# EasyEDA Pro project proyecto_diseno_2025_2.eprj

# Schematic Schematic1
Board Name: Board1; Create Date: 2025-09-25; Page Name: P1; Project Name: proyecto_diseno_2025_2; Schematic Name: Schematic1; Update Date: 2025-09-29; Company: EasyEDA.com; Page Size: A4; Version: V1.0
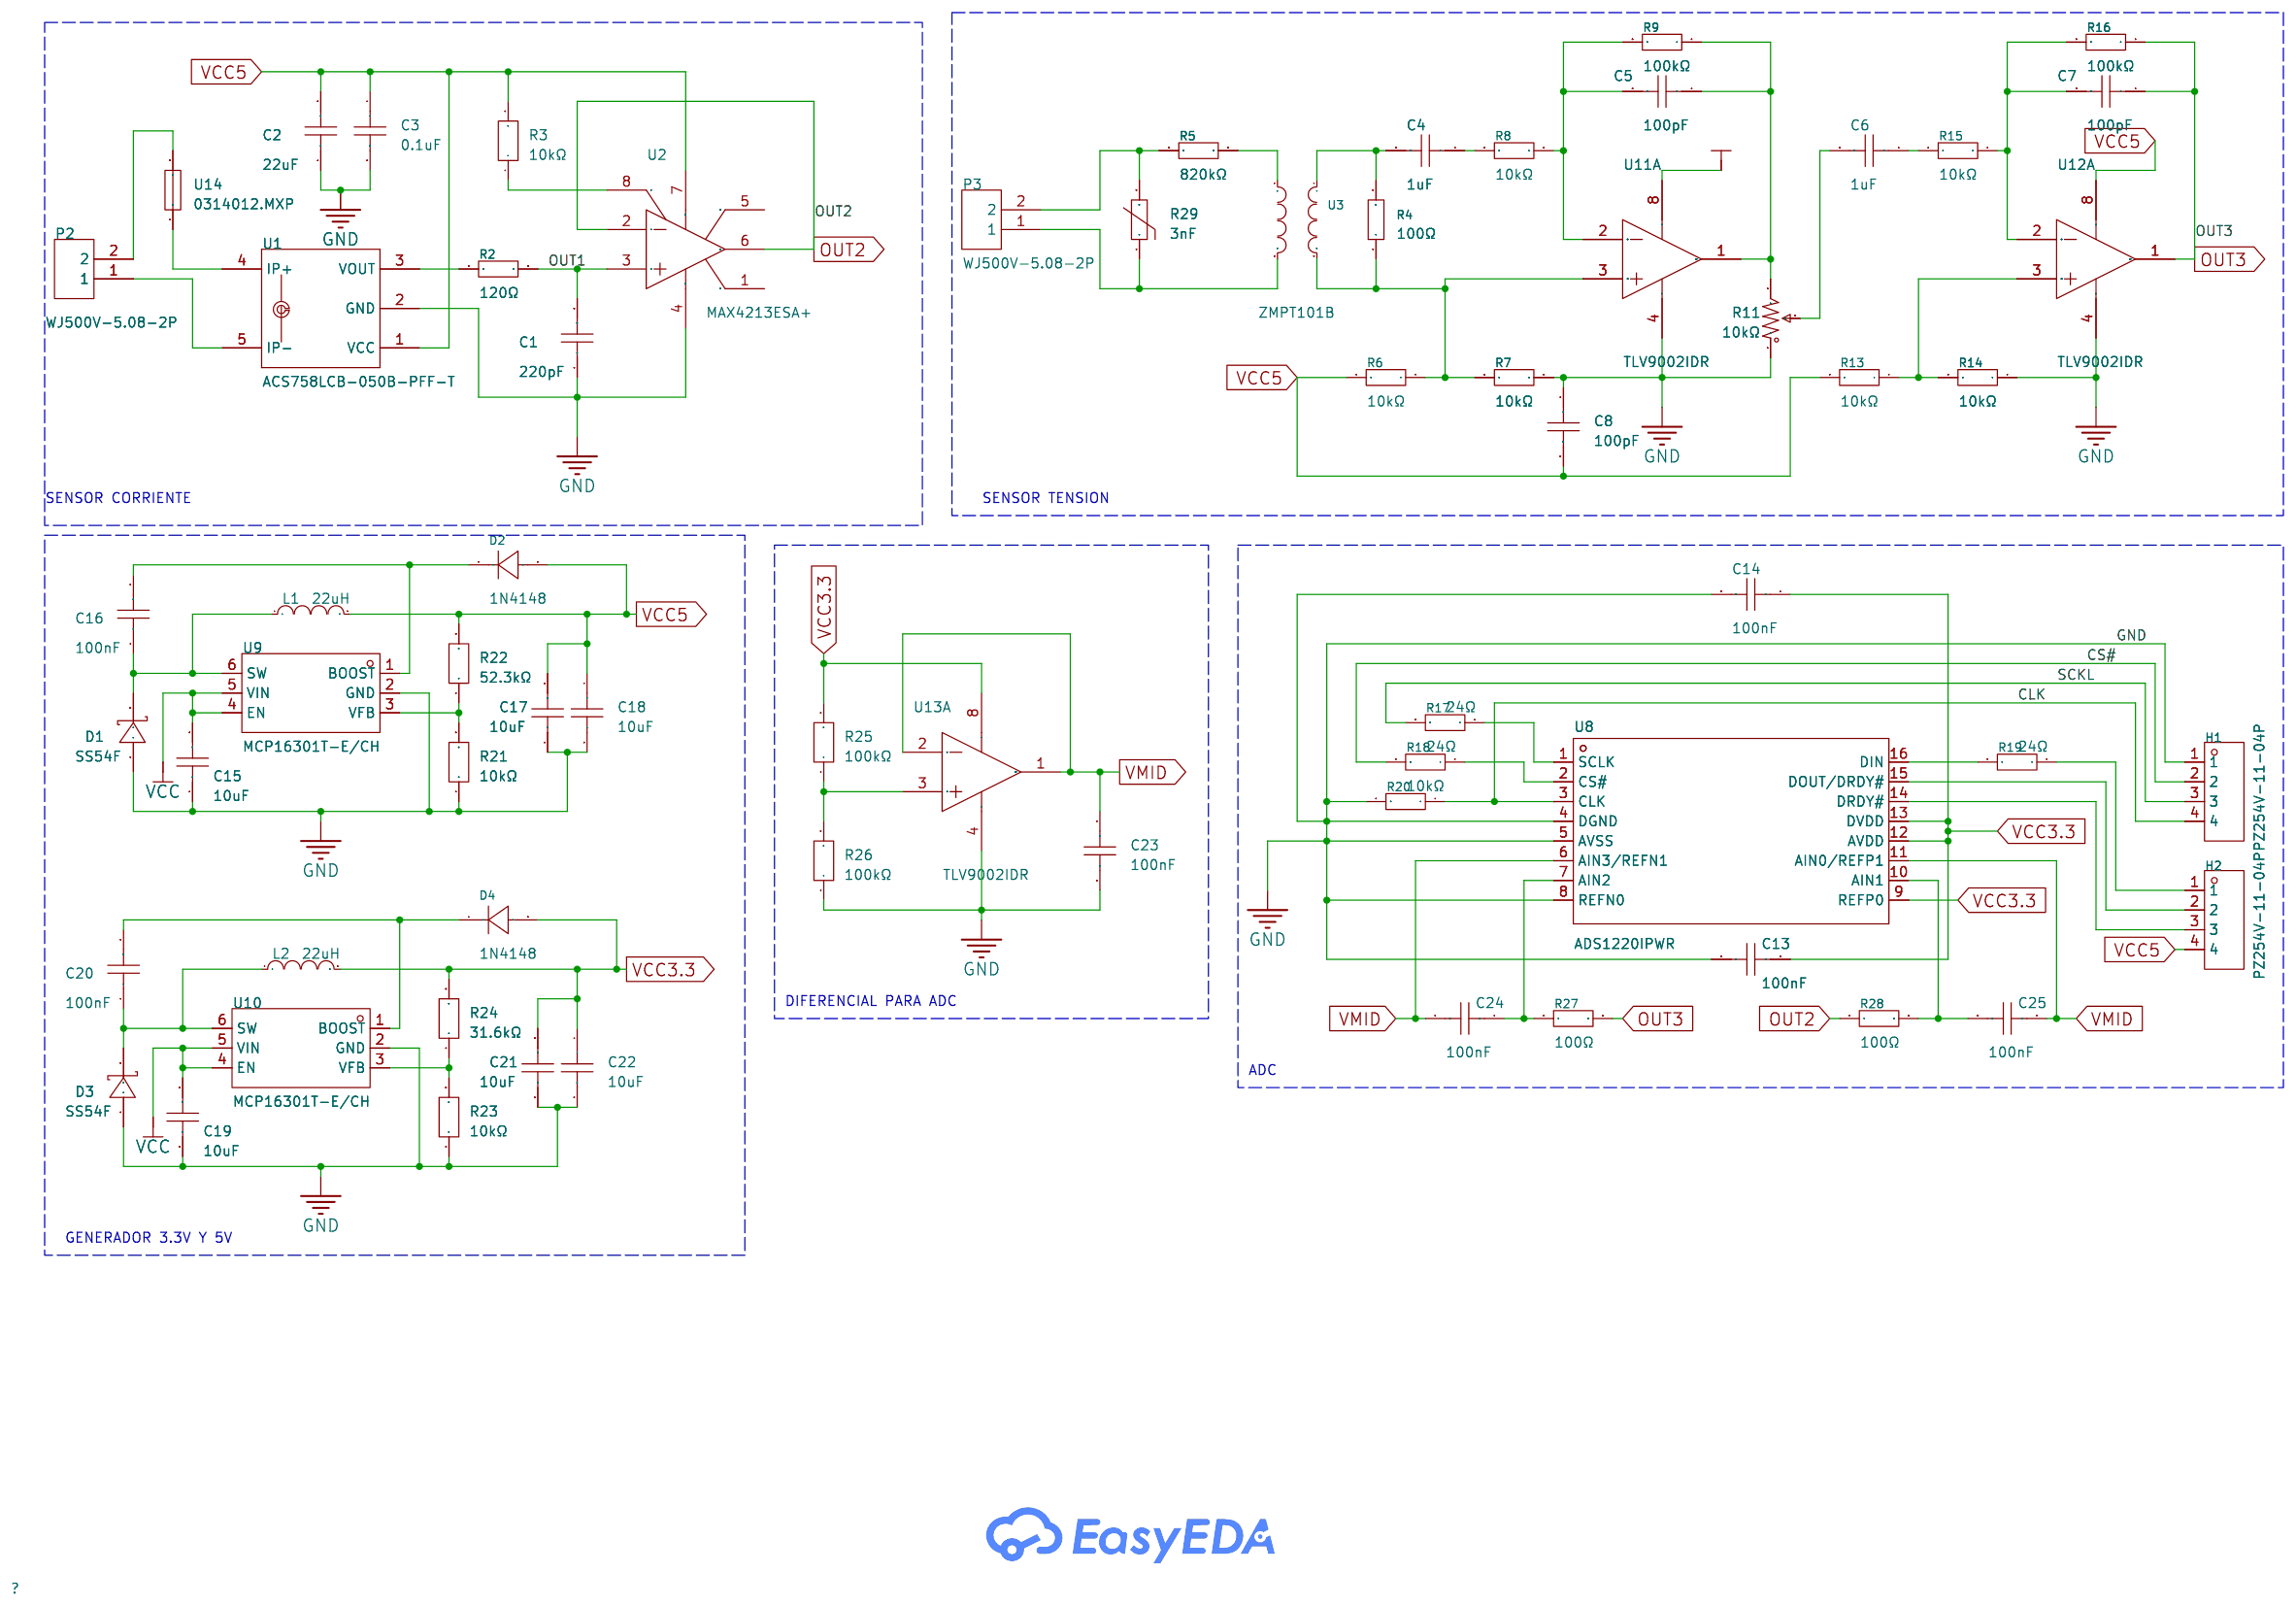
[diagram p0: schematic sheet]

## Parts
C1  220pF  [C0603]
C2  22uF  [C0603]
C3  0.1uF  [C0603]
C4  1uF  [C0603]
C5  100pF  [C0603]
C6  1uF  [C0603]
C7  100pF  [C0603]
C8  100pF  [C0603]
C13  100nF  [C0603]
C14  100nF  [C0603]
C15  10uF  [C0603]
C16  100nF  [C0603]
C17  10uF  [C0603]
C18  10uF  [C0603]
C19  10uF  [C0603]
C20  100nF  [C0603]
C21  10uF  [C0603]
C22  10uF  [C0603]
C23  100nF  [C0603]
C24  100nF  [C0603]
C25  100nF  [C0603]
D1  SS54F  [SMAF_L3.5-W2.6-LS4.7-FD]
D2  1N4148  [DO-35_BD2.0-L4.2-P8.20-D0.5-RD]
D3  SS54F  [SMAF_L3.5-W2.6-LS4.7-FD]
D4  1N4148  [DO-35_BD2.0-L4.2-P8.20-D0.5-RD]
H1  PZ254V-11-04P  [HDR-TH_4P-P2.54-V-M]
H2  PZ254V-11-04P  [HDR-TH_4P-P2.54-V-M]
L1  22uH  [L0603]
L2  22uH  [L0603]
P2  WJ500V-5.08-2P  [CONN-TH_2P-P5.00_WJ500V-5.08-2P]
P3  WJ500V-5.08-2P  [CONN-TH_2P-P5.00_WJ500V-5.08-2P]
R2  120Ω  [R0603]
R3  10kΩ  [R0603]
R4  100Ω  [R0603]
R5  820kΩ  [R0603]
R6  10kΩ  [R0603]
R7  10kΩ  [R0603]
R8  10kΩ  [R0603]
R9  100kΩ  [R0603]
R11  10kΩ  [RES-ADJ-TH_3P-L10.0-W10.0-P2.50-L]
R13  10kΩ  [R0603]
R14  10kΩ  [R0603]
R15  10kΩ  [R0603]
R16  100kΩ  [R0603]
R17  24Ω  [R0603]
R18  24Ω  [R0603]
R19  24Ω  [R0603]
R20  10kΩ  [R0603]
R21  10kΩ  [R0603]
R22  52.3kΩ  [R0603]
R23  10kΩ  [R0603]
R24  31.6kΩ  [R0603]
R25  100kΩ  [R0603]
R26  100kΩ  [R0603]
R27  100Ω  [R0603]
R28  100Ω  [R0603]
R29  3nF  [RES-TH_L15.5-W4.6-P7.50-D0.8-S3.00]
U1  ACS758LCB-050B-PFF-T  [SENSOR-TH_ACS758LCB-050B-PFF-T]
U2  MAX4213ESA+  [SO-8_L4.9-W3.9-P1.27-LS5.9-BL]
U3  ZMPT101B  [XFMR-TH_ZMPT101B]
U8  ADS1220IPWR  [TSSOP-16_L5.0-W4.4-P0.65-LS6.4-BL]
U9  MCP16301T-E/CH  [SOT-23-6_L2.9-W1.6-P0.95-LS2.8-BR]
U10  MCP16301T-E/CH  [SOT-23-6_L2.9-W1.6-P0.95-LS2.8-BR]
U11  TLV9002IDR  [SOIC-8_L4.9-W3.9-P1.27-LS6.0-BL]  (section 1)
U12  TLV9002IDR  [SOIC-8_L4.9-W3.9-P1.27-LS6.0-BL]  (section 1)
U13  TLV9002IDR  [SOIC-8_L4.9-W3.9-P1.27-LS6.0-BL]  (section 1)
U14  0314012.MXP  [FUSE-SMD_BD6.4-L31.8_0314020.MXP]

## Library data of the parts
C1-C8 C13-C25 = CC0603KRX7R9BB104: LCSC Part Name: 100nF ±10% 50V; Supplier Part: C14663; Manufacturer: YAGEO(国巨); Supplier Footprint: 0603; JLCPCB Part Class: Basic Part; Datasheet: https://item.szlcsc.com/datasheet/CC0603KRX7R9BB104/15331.html; Supplier: LCSC; Tolerance: ±10%; Voltage Rating: 50V; Temperature Coefficient: X7R
D1 D3 = SS54F_C524830: LCSC Part Name: 电压:40V 电流:5A; Supplier Part: C524830; Manufacturer: High Diode(海德); Supplier Footprint: SMAF; JLCPCB Part Class: Extended Part; Datasheet: https://item.szlcsc.com/datasheet/SS54F/542890.html; Supplier: LCSC; Diode Configuration: Independent; Voltage - Forward(Vf@If): 550mV@5A; Voltage - DC Reverse(Vr): 40V; Current - Rectified: 5A; Reverse Leakage Current (Ir): 500uA@40V; Operating Junction Temperature Range: -65℃~+150℃; Non-Repetitive Peak Forward Surge Current: 150A
D2 D4 = 1N4148_C493188: Supplier Part: C493188; Manufacturer: SMC(桑德斯); Supplier Footprint: DO-35; JLCPCB Part Class: Extended Part; Datasheet: https://item.szlcsc.com/datasheet/1N4148/503800.html; Supplier: LCSC; Diode Configuration: Independent; Voltage - Forward(Vf@If): 1V@10mA; Voltage - DC Reverse(Vr): 75V; Current - Rectified: 150mA; Reverse Leakage Current (Ir): 5uA@75V; Reverse Recovery Time (trr): 4ns; Operating Junction Temperature Range: -65℃~+175℃@(Tj); Non-Repetitive Peak Forward Surge Current: 2A
H1 H2 = PZ254V-11-04P: LCSC Part Name: 1x4P 间距:2.54mm 方针 直插; Supplier Part: C2691448; Manufacturer: XFCN(兴飞); Supplier Footprint: 插件,P=2.54mm; JLCPCB Part Class: Extended Part; Datasheet: https://item.szlcsc.com/datasheet/PZ254V-11-04P/2801085.html; Supplier: LCSC; Pin Structure: 1x4P; Pitch: 2.54mm; Circluar Pins/Square Pins: Pin Header; Mounting Type: Through Hole; Number of Rows: 1; Number of Pins: 4P; Current Rating: 3A; Voltage Rating (Max): 250V; Length of Mating Pin: 6mm; Insulation Height: 2.5mm; Length of End Connection Pin: 3mm; Operating Temperature: -40℃~+105℃; Color: Black
L1 L2 = L_0603
P2 P3 = WJ500V-5.08-2P: LCSC Part Name: 1x2P 5.08mm 直插 排数:1 每排P数:2; Supplier Part: C8465; Manufacturer: KANGNEX(康奈克斯电气); Supplier Footprint: 插件,P=5.08mm; JLCPCB Part Class: Extended Part; Datasheet: https://atta.szlcsc.com/upload/public/pdf/source/20191225/C8465_02D34CE5B5B4A53DF5891601D97FA9F4.pdf; Supplier: LCSC; Structure: 1x2P; Pitch: 5.08mm; Color: Green; Mounting Style: Direct Insert; Current Rating (Max): 18A; Voltage Rating (Max): 250V; Number of Pins: 2P; Number of Rows: 1; Wire Gauge - AWG: 14~30; Wire Gauge - mm2: 2.5; Number of PINs Per Row: 2; Operating Temperature Range: -40℃~+105℃; Screw Specification: M2.5
R2 R4-R9 R13-R20 R27 R28 = 0603WAF1200T5E: LCSC Part Name: 120Ω ±1% 100mW 厚膜电阻; Supplier Part: C22787; Manufacturer: UNI-ROYAL(厚声); Supplier Footprint: 0603; JLCPCB Part Class: Basic Part; Datasheet: https://atta.szlcsc.com/upload/public/pdf/source/20200306/C422600_1E6D84923E4A46A82E41ADD87F860B5C.pdf; Supplier: LCSC; Type: Thick Film Resistors; Tolerance: ±1%; Temperature Coefficient: ±100ppm/℃; Operating Temperature Range: -55℃~+155℃
R3 R21-R26 = FRC0603J103 TS: LCSC Part Name: 10kΩ ±5% 100mW 厚膜电阻; Supplier Part: C2930027; Manufacturer: FOJAN(富捷); Supplier Footprint: 0603; JLCPCB Part Class: Extended Part; Datasheet: https://item.szlcsc.com/datasheet/FRC0603J103%2520TS/3266960.html; Supplier: LCSC; Type: Thick Film Resistor; Tolerance: ±5%; Power(Watts): 100mW; Voltage-Supply(Max): 75V; Temperature Coefficient: ±100ppm/℃; Operating Temperature: -55℃~+155℃
R11 = 3296W-1-103_C118954: LCSC Part Name: 10kΩ ±10%; Supplier Part: C118954; Manufacturer: BOCHEN(博晨); Manufacturer Part: 3296W-1-103; Supplier Footprint: 插件-3P,9.5x4.9mm; JLCPCB Part Class: Extended Part; Datasheet: https://item.szlcsc.com/datasheet/3296W-1-103/120223.html; Supplier: LCSC; Tolerance: ±10%; Power(Watts): 500mW; Temperature Coefficient: ±250ppm/℃; Number of Turns: 30
R29 = 14D151K: Supplier Part: C49072884; Manufacturer: R+O(宏嘉诚); Supplier Footprint: 插件,P=7.5mm; JLCPCB Part Class: Extended Part; Datasheet: https://item.szlcsc.com/datasheet/14D151K/51445350.html; Supplier: LCSC; Varistor Voltage: 135V~165V; Clamping Voltage: 250V; Maximum DC Volts: 125V; Maximum AC Volts: 95V; Peak Current: 4.5kA; Energy: 47J; Rated Wattage: 600mW
U1 = ACS758LCB-050B-PFF-T_C6396157: Supplier Part: C6396157; Manufacturer: JSMSEMI(杰盛微); Supplier Footprint: CB-2-3; JLCPCB Part Class: Extended Part; Datasheet: https://atta.szlcsc.com/upload/public/pdf/source/20240105/D4861ACF7AD21FF5C22B7267E5615818.pdf; Supplier: LCSC; Current Range: ±50A; Supply Voltage: 4.5V~5.5V; Sensitivity: 40mV/A; Operating Temperature: -40℃~+150℃
U2 = MAX4213ESA+: LCSC Part Name: 微型、300MHz、单电源、 满摆幅运算放大器，带有使能端; Supplier Part: C194001; Manufacturer: ADI(亚德诺)/MAXIM(美信); Supplier Footprint: SO-8; JLCPCB Part Class: Extended Part; Datasheet: https://atta.szlcsc.com/upload/public/pdf/source/20180629/C194001_BE415C32D6D3EE348D3096D994F24335.pdf; Supplier: LCSC; Number of Channels: Single channel; Maximum Power Supply Range (Vdd-Vss): 10V; Vos - Input Offset Voltage: 9mV; Input Offset Voltage Drift(Vos TC): 8uV/℃; Slew Rate: 600V/us; Ib - Input Bias Current: 20uA; Noise density(eN): 10nV/√Hz@10kHz; Common Mode Rejection Ratio(CMRR): 100dB; Operating Temperature: -40℃~+85℃; Single supply: 3.3V~10V; Dual Supply: -5V~5V
U3 = ZMPT101B: Supplier Part: C111858; Manufacturer: 择明朗熙; Supplier Footprint: 插件; JLCPCB Part Class: Extended Part; Datasheet: https://item.szlcsc.com/datasheet/ZMPT101B/113087.html; Supplier: LCSC
U8 = ADS1220IPWR: LCSC Part Name: 具备集成特性的24位模数转换器（ADC）; Supplier Part: C48263; Manufacturer: TI(德州仪器); Supplier Footprint: TSSOP-16; JLCPCB Part Class: Extended Part; Datasheet: https://www.ti.com/cn/lit/gpn/ads1220; Supplier: LCSC; Resolution(Bits): 24; Sampling Rate: 2kHz; number of channels: 2; Voltage - Supply: 2.3V~5.5V; Interface: SPI; Integral non - linearity: 6LSB; Operating Temperature: -40℃~+125℃
U9 U10 = MCP16301T-E/CH: LCSC Part Name: 高输入电压集成开关降压稳压器; Supplier Part: C510952; Manufacturer: MICROCHIP(美国微芯); Supplier Footprint: SOT-23-6; JLCPCB Part Class: Extended Part; Datasheet: https://atta.szlcsc.com/upload/public/pdf/source/20200413/C510952_E610A357558B8BF4E97D896379FB269B.pdf; Supplier: LCSC; Function: Step-down type; Input Voltage: 4V~30V; Output Voltage: 2V~15V; Switching Frequency: 500kHz; Operating Temperature: -40℃~+125℃; Synchronous Rectification: No; Number of Outputs: 1; Topology: Step-down; Switch tube (built-in/external): Built-in
U11-U13 = TLV9002IDR: Supplier Part: C398360; Manufacturer: TI(德州仪器); Supplier Footprint: SOIC-8; JLCPCB Part Class: Extended Part; Datasheet: https://www.ti.com/cn/lit/gpn/tlv9001; Supplier: LCSC; Number of Channels: Dual; Maximum Power Supply Range (Vdd-Vss): 5.5V; Vos - Input Offset Voltage: 1.6mV; Input Offset Voltage Drift(Vos TC): 0.6uV/℃; Slew Rate: 2V/us; Ib - Input Bias Current: 5pA; Noise density(eN): 4.7nV/√Hz@1kHz; Common Mode Rejection Ratio(CMRR): 86dB; Operating Temperature: -40℃~+125℃; Single supply: 1.8V~5.5V
U14 = 0314012.MXP: LCSC Part Name: 陶瓷管保险丝; Supplier Part: C178958; Manufacturer: Littelfuse(美国力特); Supplier Footprint: D6.35xL31.75mm; JLCPCB Part Class: Extended Part; Datasheet: https://atta.szlcsc.com/upload/public/pdf/source/20180418/C178964_AE1BF21D3634C90D461420CDCD1F556D.pdf; Supplier: LCSC; Type: Ceramic Tube Fuse; Current Rating: 12A

## Nets
GND: C1.1 C2.1 C3.2 C8.1 C13.2 C14.2 C15.1 C17.1 C18.2 C19.1 C21.1 C22.2 C23.2 D1.1(A) D3.1(A) H1.1 R7.1 R11.1 R14.1 R20.2 R21.1 R23.1 R26.1 U1.2(GND) U2.4(VEE) U8.4(DGND) U8.5(AVSS) U8.8(REFN0) U9.2(GND) U10.2(GND) U11.4(V-) U12.4(V-) U13.4(V-)
VCC: C15.2 C19.2 U9.4(EN) U9.5(VIN) U10.4(EN) U10.5(VIN)
VCC3.3: C13.1 C14.1 C21.2 C22.1 D4.2(A) L2.2 R24.2 R25.2 U8.9(REFP0) U8.12(AVDD) U8.13(DVDD) U13.8(V+)
VCC5: C2.2 C3.1 C8.2 C17.2 C18.1 D2.2(A) H2.4 L1.2 R3.2 R6.2 R13.2 R22.2 U1.1(VCC) U2.7(VCC) U11.8(V+) U12.8(V+)
CLK: H1.4 R20.1 U8.3(CLK)
CS#: H1.2 R18.2
OUT1: C1.2 R2.2 U2.3(IN+)
OUT2: R28.1 U2.2(IN-) U2.6(OUT)
OUT3: C7.1 R16.1 R27.2 U12.1(OUT1)
SCKL: H1.3 R17.2
VMID: C23.1 C24.2 C25.1 U8.6(AIN3/REFN1) U8.11(AIN0/REFP1) U13.1(OUT1) U13.2(IN1-)
$1N669: P2.1 U1.5(IP-)
$1N800: R2.1 U1.3(VOUT)
$1N841: R3.1 U2.8(EN)
$1N1423: P3.1 R29.1 U3.2
$1N1466: R5.1 U3.1
$1N1469: P3.2 R5.2 R29.2
$1N1526: C4.2 R4.2 U3.4
$1N1768: R4.1 R6.1 R7.2 U3.3 U11.3(IN1+)
$1N1889: C4.1 R8.2
$1N1927: C5.1 R9.1 R11.3 U11.1(OUT1)
$1N1958: C5.2 R8.1 R9.2 U11.2(IN1-)
$1N2705: C6.2 R11.2
$1N2722: C6.1 R15.2
$1N2731: C7.2 R15.1 R16.2 U12.2(IN1-)
$1N2751: R13.1 R14.2 U12.3(IN1+)
$1N4149: R17.1 U8.1(SCLK)
$1N4155: R18.1 U8.2(CS#)
$1N4162: R19.2 U8.16(DIN)
$1N4196: C24.1 R27.1 U8.7(AIN2)
$1N4201: C25.2 R28.2 U8.10(AIN1)
$1N4991: H2.3 U8.14(DRDY#)
$1N5106: H2.1 R19.1
$1N5113: H2.2 U8.15(DOUT/DRDY#)
$1N6988: R21.2 R22.1 U9.3(VFB)
$1N7005: C16.1 D1.2(K) L1.1 U9.6(SW)
$1N7153: C16.2 D2.1(K) U9.1(BOOST)
$1N7802: R23.2 R24.1 U10.3(VFB)
$1N7806: C20.1 D3.2(K) L2.1 U10.6(SW)
$1N7825: C20.2 D4.1(K) U10.1(BOOST)
$1N8191: R25.1 R26.2 U13.3(IN1+)
$1N8643: P2.2 U14.2
$1N8649: U1.4(IP+) U14.1

Not connected (* = marked no-connect by the designer): U2 1(NC) 5(NC)

## Notes on the sheet
- SENSOR CORRIENTE
- SENSOR TENSION
- DIFERENCIAL PARA ADC
- ADC
- GENERADOR 3.3V Y 5V

# Board PCB1
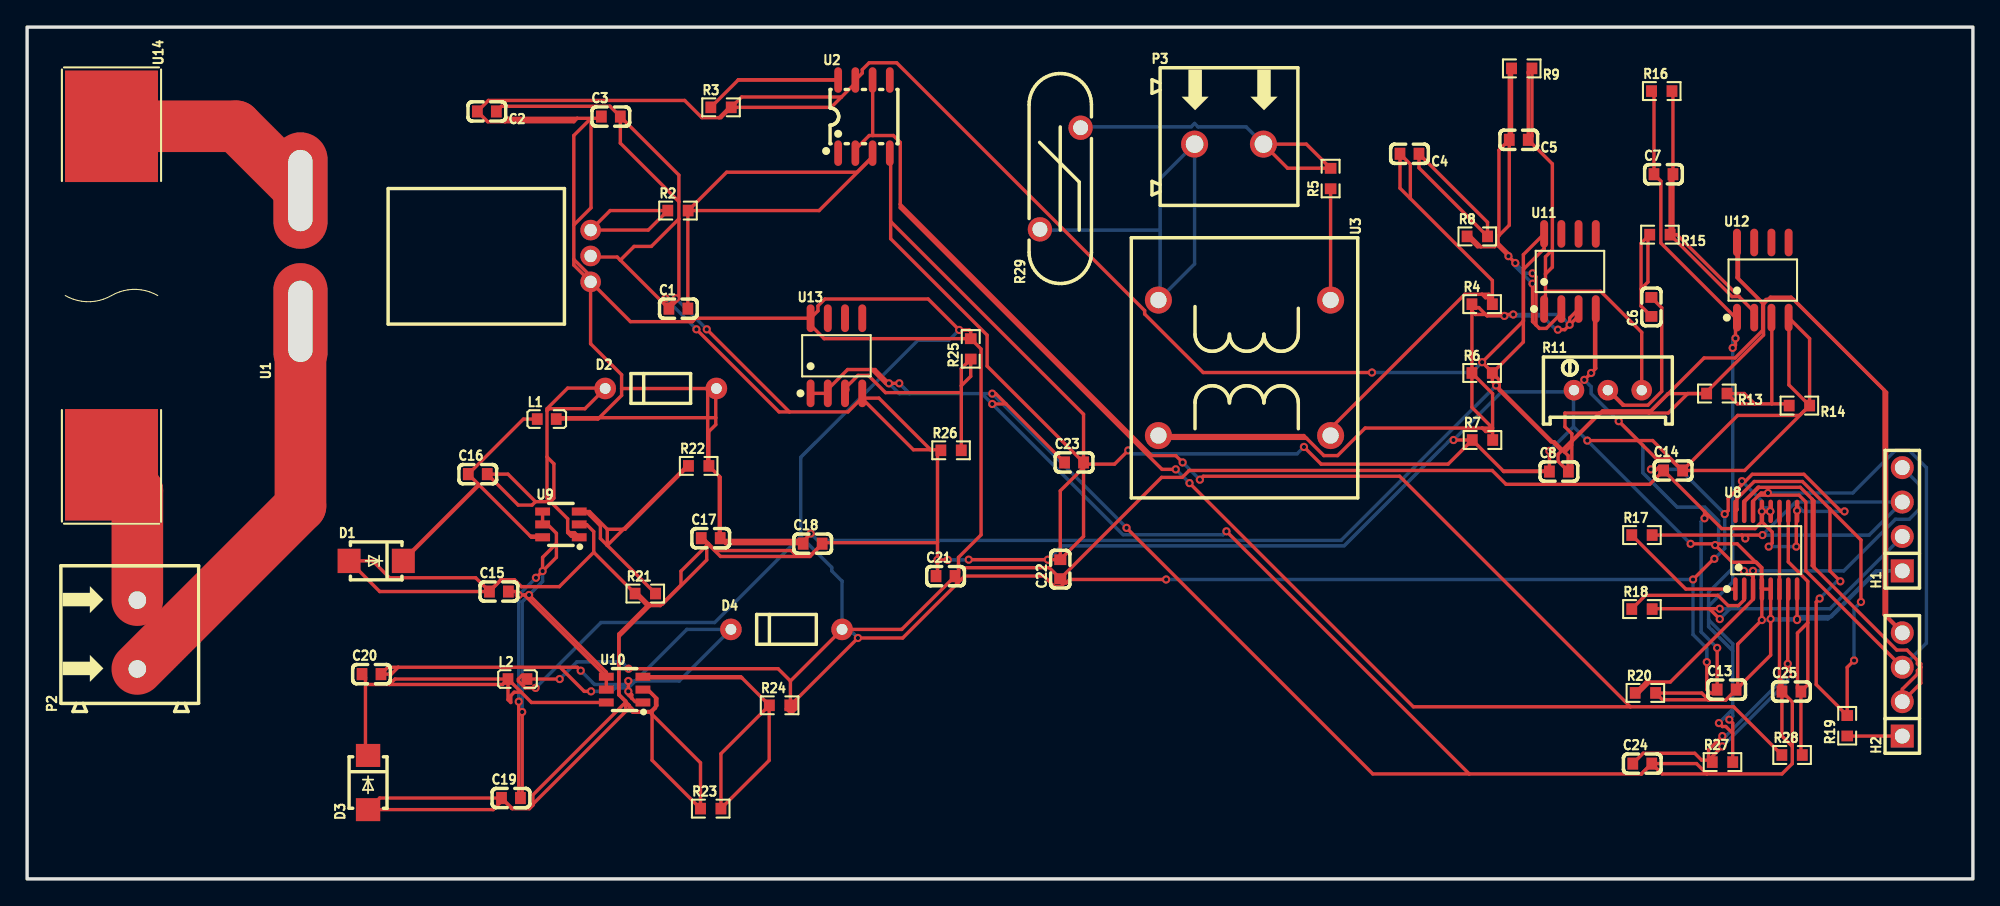
[diagram p1: board, top side]
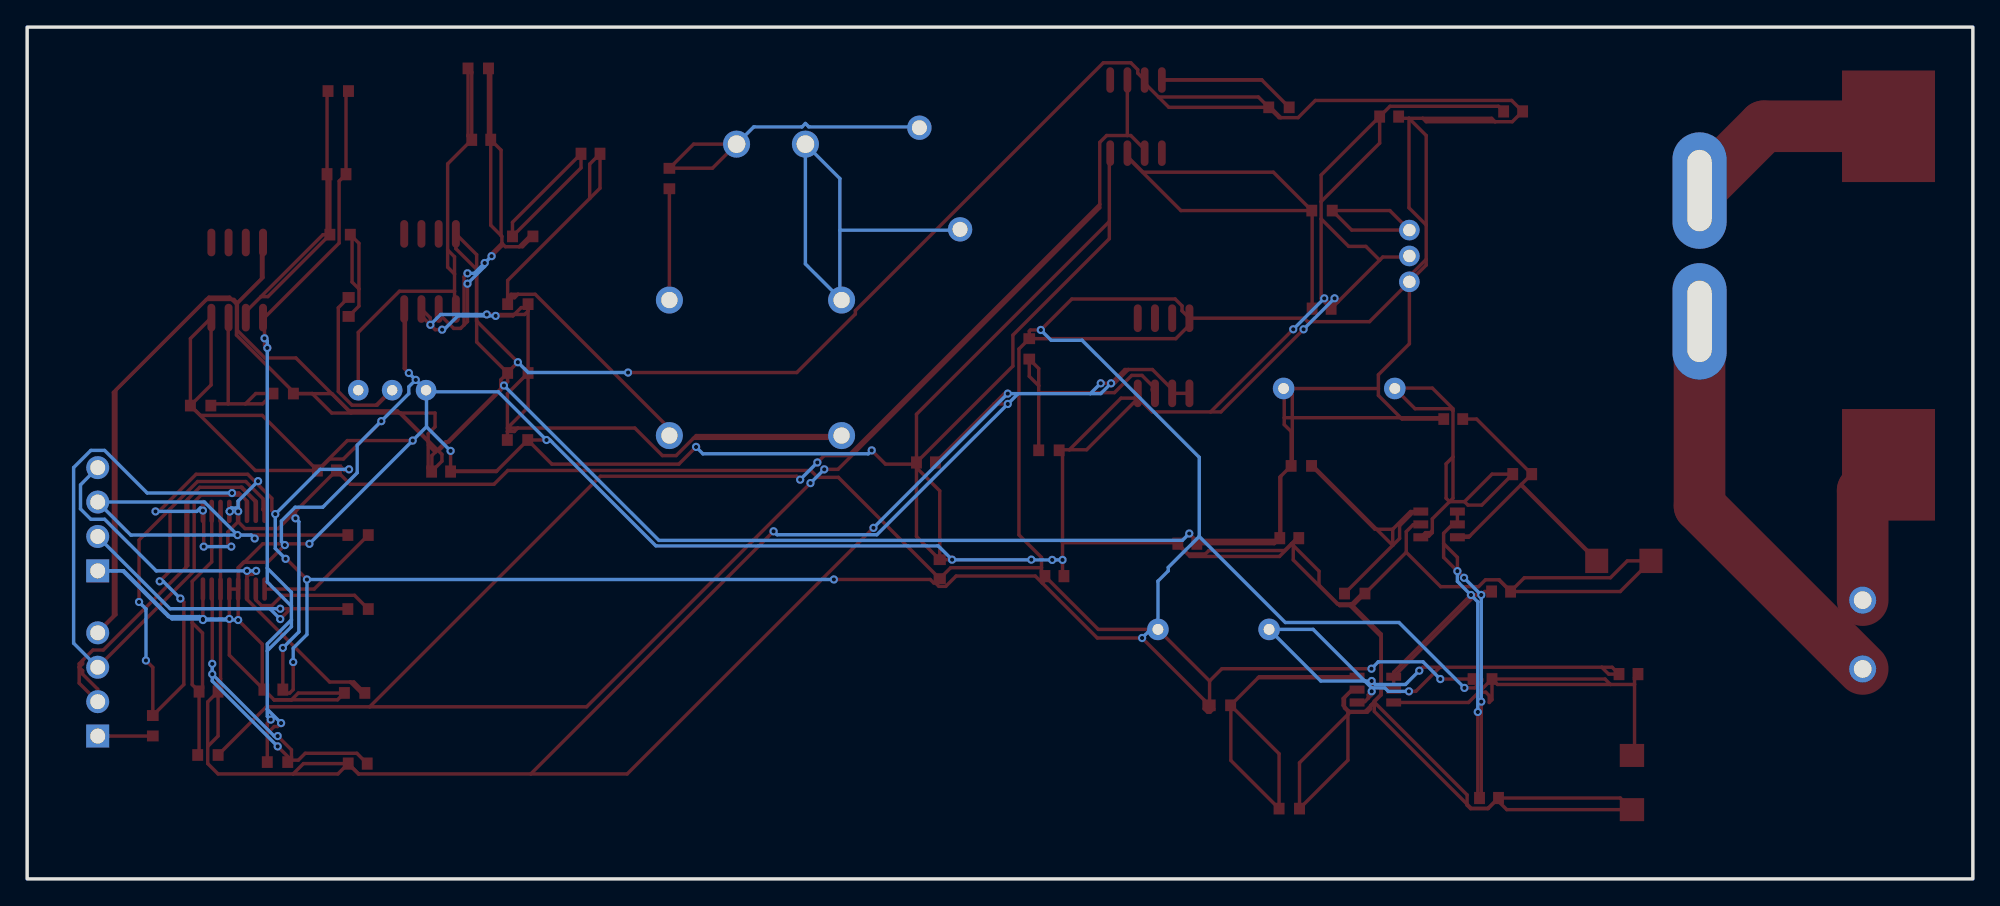
[diagram p2: board, bottom side, seen from below]

Outline 143.51 x 62.86 mm; copper layers: Top Layer, Bottom Layer. Coordinates in mm from the lower left corner of the outline.
Outline path: rectangle 0,62.86 143.51,0
Stack: Top Layer 0.035mm / Dielectric1 1.51mm FR4 er 4.5 / Bottom Layer 0.035mm

## Design rules (mm)
template: JLCPCB Capability(Two Layers Board)
spacing copperThickness1oz (default): track to track 0.102, other pairs 0.152 to 0.3
spacing copperThickness2oz: track to track 0.203, other pairs 0.152 to 0.3
track width copperThickness1oz (default): min 0.127, default 0.254, max 2.54
track width copperThickness2oz: min 0.203, default 0.254, max 2.54
differential pair differentialPair (default): width min 0.127, default 0.254, max 2.54; gap min 0.152, default 0.152
via viaSize (default): diameter min 0.5, default 0.61, max 10; hole min 0.3, default 0.305, max 6.3

## Placement (name value [footprint] x y rotation side)
C1  220pF  [C0603]  48.03 42.08 0 top
C2  22uF  [C0603]  33.91 56.64 180 top
C3  0.1uF  [C0603]  43.05 56.26 0 top
C4  1uF  [C0603]  101.96 53.51 180 top
C5  100pF  [C0603]  110.02 54.55 180 top
C6  1uF  [C0603]  119.8 42.21 90 top
C7  100pF  [C0603]  120.69 52.01 0 top
C8  100pF  [C0603]  112.98 30.06 0 top
C13  100nF  [C0603]  125.35 13.97 0 top
C14  100nF  [C0603]  121.4 30.14 0 top
C15  10uF  [C0603]  34.8 21.21 0 top
C16  100nF  [C0603]  33.24 29.87 0 top
C17  10uF  [C0603]  50.42 25.15 0 top
C18  10uF  [C0603]  57.94 24.74 0 top
C19  10uF  [C0603]  35.69 5.97 0 top
C20  100nF  [C0603]  25.4 15.11 0 top
C21  10uF  [C0603]  67.74 22.34 0 top
C22  10uF  [C0603]  76.2 22.86 90 top
C23  100nF  [C0603]  77.22 30.73 0 top
C24  100nF  [C0603]  119.13 8.51 0 top
C25  100nF  [C0603]  130.13 13.83 0 top
D1  SS54F  [SMAF_L3.5-W2.6-LS4.7-FD]  25.75 23.47 0 top
D2  1N4148  [DO-35_BD2.0-L4.2-P8.20-D0.5-RD]  46.74 36.19 0 top
D3  SS54F  [SMAF_L3.5-W2.6-LS4.7-FD]  25.15 7.11 90 top
D4  1N4148  [DO-35_BD2.0-L4.2-P8.20-D0.5-RD]  56.01 18.41 0 top
H1  PZ254V-11-04P  [HDR-TH_4P-P2.54-V-M]  138.3 26.54 90 top
H2  PZ254V-11-04P  [HDR-TH_4P-P2.54-V-M]  138.3 14.35 90 top
L1  22uH  [L0603]  38.33 33.94 0 top
L2  22uH  [L0603]  36.17 14.75 0 top
P2  WJ500V-5.08-2P  [CONN-TH_2P-P5.00_WJ500V-5.08-2P]  8.13 18.03 90 top
P3  WJ500V-5.08-2P  [CONN-TH_2P-P5.00_WJ500V-5.08-2P]  88.65 54.23 0 top
R2  120Ω  [R0603]  48.01 49.32 0 top
R3  10kΩ  [R0603]  51.18 56.94 0 top
R4  100Ω  [R0603]  107.31 42.42 0 top
R5  820kΩ  [R0603]  96.14 51.69 90 top
R6  10kΩ  [R0603]  107.31 37.34 0 top
R7  10kΩ  [R0603]  107.34 32.39 0 top
R8  10kΩ  [R0603]  106.96 47.42 0 top
R9  100kΩ  [R0603]  110.24 59.82 180 top
R11  10kΩ  [RES-ADJ-TH_3P-L10.0-W10.0-P2.50-L]  116.59 36.07 0 top
R13  10kΩ  [R0603]  124.62 35.82 180 top
R14  10kΩ  [R0603]  130.71 34.93 180 top
R15  10kΩ  [R0603]  120.43 47.55 180 top
R16  100kΩ  [R0603]  120.56 58.14 0 top
R17  24Ω  [R0603]  119.1 25.38 0 top
R18  24Ω  [R0603]  119.1 19.91 0 top
R19  24Ω  [R0603]  134.24 11.3 90 top
R20  10kΩ  [R0603]  119.36 13.73 0 top
R21  10kΩ  [R0603]  45.59 21.06 0 top
R22  52.3kΩ  [R0603]  49.53 30.48 0 top
R23  10kΩ  [R0603]  50.42 5.19 0 top
R24  31.6kΩ  [R0603]  55.5 12.81 0 top
R25  100kΩ  [R0603]  69.6 39.12 90 top
R26  100kΩ  [R0603]  68.15 31.63 0 top
R27  100Ω  [R0603]  125.04 8.62 0 top
R28  100Ω  [R0603]  130.18 9.14 0 top
R29  3nF  [RES-TH_L15.5-W4.6-P7.50-D0.8-S3.00]  76.2 51.69 90 top
U1  ACS758LCB-050B-PFF-T  [SENSOR-TH_ACS758LCB-050B-PFF-T]  30.86 45.97 90 top
U2  MAX4213ESA+  [SO-8_L4.9-W3.9-P1.27-LS5.9-BL]  61.72 56.26 0 top
U3  ZMPT101B  [XFMR-TH_ZMPT101B]  89.79 37.72 270 top
U8  ADS1220IPWR  [TSSOP-16_L5.0-W4.4-P0.65-LS6.4-BL]  128.27 24.26 0 top
U9  MCP16301T-E/CH  [SOT-23-6_L2.9-W1.6-P0.95-LS2.8-BR]  39.37 26.16 0 top
U10  MCP16301T-E/CH  [SOT-23-6_L2.9-W1.6-P0.95-LS2.8-BR]  44.07 13.97 0 top
U11  TLV9002IDR  [SOIC-8_L4.9-W3.9-P1.27-LS6.0-BL]  113.79 44.83 0 top
U12  TLV9002IDR  [SOIC-8_L4.9-W3.9-P1.27-LS6.0-BL]  128.02 44.2 0 top
U13  TLV9002IDR  [SOIC-8_L4.9-W3.9-P1.27-LS6.0-BL]  59.69 38.61 0 top
U14  0314012.MXP  [FUSE-SMD_BD6.4-L31.8_0314020.MXP]  6.22 43.05 270 top

## Footprints (pads in the part's own frame, mm; a bottom-side part is the same pattern mirrored in y, then rotated)
C0603
  rect 0.8x0.9 smd: 1(-0.7,0) 2(0.7,0)
CONN-TH_2P-P5.00_WJ500V-5.08-2P
  round 2 hole 1.3: 1(-2.54,0) 2(2.54,0)
DO-35_BD2.0-L4.2-P8.20-D0.5-RD
  round 1.6 hole 0.8: 1(-4.1,0) 2(4.1,0)
FUSE-SMD_BD6.4-L31.8_0314020.MXP
  rect 8.235x6.858 smd: 1(-12.492,0) 2(12.492,0)
HDR-TH_4P-P2.54-V-M
  rect 1.7x1.7 hole 1.1: 1(-3.81,0)
  round 1.7 hole 1.1: 2(-1.27,0) 3(1.27,0) 4(3.81,0)
L0603
  rect 0.8x0.864 smd: 1(-0.7,0) 2(0.7,0)
R0603
  rect 0.806x0.864 smd: 1(-0.753,0) 2(0.753,0)
RES-ADJ-TH_3P-L10.0-W10.0-P2.50-L
  round 1.524 hole 0.762: 1(-2.5,0) 2(0,0) 3(2.5,0)
RES-TH_L15.5-W4.6-P7.50-D0.8-S3.00
  round 1.8 hole 1.1: 1(-3.75,1.5) 2(3.75,-1.5)
SENSOR-TH_ACS758LCB-050B-PFF-T
  round 1.524 hole 0.914: 1(-1.91,-10.7) 2(0,-10.7) 3(1.91,-10.7)
  oval 8.6x4 hole 6x1.8: 4(4.826,10.7) 5(-4.826,10.7)
SMAF_L3.5-W2.6-LS4.7-FD
  rect 1.7x1.8 smd: 1(-2,0) 2(2,0)
SO-8_L4.9-W3.9-P1.27-LS5.9-BL
  oval 0.574x1.888 smd: 1(-1.905,-2.699) 2(-0.635,-2.699) 3(0.635,-2.699) 4(1.905,-2.699) 5(1.905,2.699) 6(0.635,2.699) 7(-0.635,2.699) 8(-1.905,2.699)
SOIC-8_L4.9-W3.9-P1.27-LS6.0-BL
  oval 0.588x2.045 smd: 1(-1.905,-2.772) 2(-0.635,-2.772) 3(0.635,-2.772) 4(1.905,-2.772) 5(1.905,2.772) 6(0.635,2.772) 7(-0.635,2.772) 8(-1.905,2.772)
SOT-23-6_L2.9-W1.6-P0.95-LS2.8-BR
  rect 1.1x0.6 smd: 1(1.35,-0.95) 2(1.35,0) 3(1.35,0.95) 4(-1.35,0.95) 5(-1.35,0) 6(-1.35,-0.95)
TSSOP-16_L5.0-W4.4-P0.65-LS6.4-BL
  oval 0.343x1.732 smd: 1(-2.275,-2.866) 2(-1.625,-2.866) 3(-0.975,-2.866) 4(-0.325,-2.866) 5(0.325,-2.866) 6(0.975,-2.866) 7(1.625,-2.866) 8(2.275,-2.866) 9(2.275,2.866) 10(1.625,2.866) 11(0.975,2.866) 12(0.325,2.866) 13(-0.325,2.866) 14(-0.975,2.866) 15(-1.625,2.866) 16(-2.275,2.866)
XFMR-TH_ZMPT101B
  round 2 hole 1.2: 1(-5,6.35) 2(-5,-6.35) 3(5,-6.35) 4(5,6.35)

## Nets
As in the schematic.

Pads without a net: U2 1 5; U11 5 6 7; U12 5 6 7; U13 5 6 7

## Via types
v1: diameter 0.61, hole 0.305, Top Layer to Bottom Layer, 94 vias

## Routing (per net, layer and track width the routed paths; a pad name or vN(x,y) marks a point on that pad's centre or on a via; arc(x,y) is an arc through that point)
GND: length 614.4
  Top Layer w0.254: 50.13,24.61 50.13,23.54 46.88,20.3 46.83,20.3 ; 50.13,24.61 50.23,24.71 ; 50.13,24.61 50.13,24.81 ; 50.13,24.61 48.23,22.71 48.23,21.69 46.83,20.3 ; 34.99,5.72 C19.1 ; 34.99,5.72 34.38,5.11 D3.1 26,5.97 C19.1 ; 34.99,5.72 35.02,5.69 35.27,5.69 ; C19.1 35.27,5.69 ; 50.13,24.81 49.95,24.99 ; 50.13,24.81 50.23,24.71 ; 49.95,24.99 49.79,25.15 C17.1 49.87,24.99 49.95,24.99 ; 49.95,24.99 50,24.99 50.26,24.74 ; C23.2 77.92,34.29 63.69,48.51 ; C23.2 70.8,37.85 70.8,40.13 63.69,47.24 63.69,48.51 ; C23.2 77.92,30.61 ; C3.2 42.99,57.02 34.99,57.02 C2.1 ; C3.2 48.07,51.94 48.07,49.98 ; C3.2 43.75,54.3 48.07,49.98 ; 46.83,20.3 45.86,20.3 ; 46.83,20.3 46.7,20.17 45.94,20.17 ; C8.1 112.17,30.11 108.87,30.11 ; C8.1 108.91,30.06 108.87,30.11 ; C8.1 v1(112.28,31.59) ; 108.87,30.11 R7.1 ; 44.15,13.07 44.15,13.12 43.65,13.62 ; 44.15,13.07 43.65,13.56 43.65,13.62 ; 44.15,13.07 44.15,13.04 ; 44.15,13.07 44.16,13.06 ; 35.76,5.21 35.75,5.21 35.27,5.69 ; 35.76,5.21 35.78,5.18 37.05,5.18 37.3,5.44 37.3,5.51 ; 35.76,5.21 37,5.21 37.3,5.51 ; 35.76,5.21 35.27,5.69 35.27,5.69 ; 50.23,24.71 51.14,23.8 57.75,23.8 58.76,24.81 ; 50.23,24.71 50.26,24.74 ; 77.92,30.36 76.2,28.64 C22.2 ; 77.92,30.36 77.92,30.61 ; 77.92,30.36 77.92,25.28 C22.2 ; C14.2 126.16,34.21 130.72,34.21 R14.1 ; C14.2 119.89,32.35 118.82,32.35 ; C14.2 121.96,30.23 121.2,30.99 120.18,30.99 118.82,32.35 ; C14.2 126.68,30.14 R14.1 ; 43.65,13.62 43.65,17.88 45.94,20.17 ; 43.65,13.62 43.64,13.63 43.64,18.07 45.84,20.27 ; 66.64,31.67 65.37,31.67 61.56,35.48 ; 66.64,31.67 67.15,31.67 ; 66.64,31.67 62.83,35.48 61.56,35.48 ; 37.3,5.51 37.3,6.2 44.15,13.04 ; 37.3,5.51 44.15,12.36 44.15,12.87 ; C13.2 128.59,16.52 v1(128.59,19.19) U8.5 U8.4 ; C13.2 125.3,13.22 ; C13.2 126.17,14.28 126.17,17.33 v1(127.94,19.1) U8.4 ; R14.1 129.94,36.46 129.94,41.28 U12.4 131.47,39.88 R14.1 ; 44.15,12.87 44.32,12.87 44.42,12.77 ; 44.15,12.87 44.15,13.04 ; 58.76,24.81 67.15,24.81 ; 58.76,24.81 C18.2 57.88,23.98 56.61,23.98 56.35,24.23 50.77,24.23 50.26,24.74 ; 124.01,13.22 124.02,13.21 125.29,13.21 125.3,13.22 ; 124.01,13.22 120.62,13.22 R20.2 120.21,13.72 123.51,13.72 124.01,13.22 ; 124.01,13.22 125.3,13.22 ; 45.94,12.29 44.67,12.29 44.42,12.55 44.42,12.77 ; 45.94,12.29 46,12.36 ; 45.94,12.29 46.09,12.14 ; 67.15,22.53 67.15,22.45 67.04,22.34 67.04,22.42 67.15,22.53 ; 67.15,22.53 v1(67.15,23.54) ; 44.15,13.04 44.16,13.06 ; 61.56,35.48 61.56,35.73 ; 61.56,35.48 60.54,34.46 56.22,34.46 ; 61.56,35.73 U13.4 61.56,35.8 61.56,35.73 ; U8.4 127.94,22.97 127.55,23.37 127.49,23.37 ; U8.4 127.91,21.43 127.91,22.95 127.49,23.37 ; 48.07,48.71 48.07,42.82 C1.1 ; 48.07,48.71 48.07,49.98 ; 48.07,48.71 46.04,46.68 44.77,46.68 43.75,45.66 ; v1(81.22,31.63) 80.2,30.61 77.92,30.61 ; 44.16,13.06 44.42,12.8 44.42,12.77 ; 118.82,32.35 v1(117.39,33.78) ; 118.82,32.35 v1(115.07,32.35) ; 45.75,13.97 46.35,13.37 46.35,12.7 ; 45.75,13.97 U10.2 ; 45.75,13.97 45.79,13.97 46.45,13.31 46.45,12.8 46.35,12.7 ; C15.1 33.08,22.22 26.73,22.22 25.49,23.47 D1.1 26.01,21.21 C15.1 ; C15.1 34.96,22.07 ; C15.1 34.17,21.31 34.93,22.07 34.96,22.07 ; U2.4 63.69,53.5 63.69,48.51 ; 45.81,20.3 45.6,20.3 R21.1 ; 45.81,20.3 45.05,21.06 R21.1 ; 45.81,20.3 45.86,20.3 ; 45.81,20.3 45.84,20.27 ; 44.42,12.77 44.82,12.36 46,12.36 ; R21.1 41.79,24.11 ; 67.15,31.67 R26.1 ; 67.15,31.67 67.15,24.81 ; 67.15,24.81 v1(67.15,23.54) ; 34.96,22.07 35.95,22.07 36.46,21.57 39.25,21.57 41.79,24.11 ; v1(122.69,24.73) 126.13,24.73 127.49,23.37 ; 45.94,20.17 45.84,20.27 ; C22.2 v1(75.29,23.56) v1(69.45,23.56) ; 46.09,12.36 46.35,12.61 46.35,12.7 ; 46.09,12.36 46.09,12.14 ; 46.09,12.36 46,12.36 ; 45.86,20.3 45.84,20.27 ; 41.03,26.14 40.74,26.14 U9.2 41.03,26.14 ; 41.03,26.14 41.28,26.14 41.79,25.63 41.79,24.11 ; 46.83,42.59 v1(47.08,42.85) ; 46.83,42.59 43.75,45.66 ; 46.83,42.59 C1.1 ; 46,12.36 46.35,12.7 ; v1(67.15,23.54) v1(67.91,23.54) ; 115.61,37.59 115.7,37.68 U11.4 115.61,41.91 115.61,37.59 ; 115.61,37.59 v1(115.36,37.34) v1(114.85,36.83) ; 46.09,12.14 46.09,8.76 R23.1 49.67,8.57 46.09,12.14 ; 43.75,45.66 43.52,45.89 41.64,45.89 U1.2 ; 127.49,23.37 125.77,23.37 v1(124.5,24.64) ; 56.22,34.46 55.46,34.46 v1(49.37,40.56) ; 56.22,34.46 v1(50.13,40.56) ; R7.1 104.81,30.61 95.44,30.61 v1(94.17,31.88) ; R7.1 v1(105.2,32.39) ; v1(130.55,19.1) U8.8 ; C1.1 47.33,42.34 v1(47.84,42.85)
  Bottom Layer w0.254: v1(127.94,19.1) v1(130.55,19.1) 130.63,19.19 ; v1(114.85,36.83) 115.36,36.32 115.36,35.81 v1(117.39,33.78) 119.17,32 119.17,29.97 121.71,27.43 123.74,27.43 124.75,26.42 124.75,24.89 v1(124.5,24.64) ; v1(114.85,36.83) R11.1 114.06,36.04 ; v1(114.85,36.83) v1(115.36,37.34) ; 133,19.36 130.8,19.36 130.63,19.19 ; 133,19.36 132.83,19.19 130.63,19.19 ; 133,19.36 136.39,22.74 138.29,22.74 H1.1 136.46,22.73 133.09,19.36 133,19.36 ; v1(112.28,31.59) 114.06,33.37 ; 114.06,33.37 114.06,36.04 ; 114.06,33.37 v1(115.07,32.35) v1(122.69,24.73) ; v1(94.17,31.88) 93.66,31.37 81.47,31.37 v1(81.22,31.63) ; v1(47.84,42.85) v1(50.13,40.56) ; 69.43,23.54 v1(67.91,23.54) v1(67.15,23.54) ; 69.43,23.54 75.27,23.54 v1(75.29,23.56) 76.31,24.58 97.13,24.58 104.95,32.39 v1(105.2,32.39) 108.76,35.95 113.97,35.95 114.06,36.04 ; 69.43,23.54 v1(69.45,23.56) ; v1(47.08,42.85) v1(49.37,40.56) ; 130.63,19.19 v1(130.55,19.19) v1(128.59,19.19)
VCC: length 62.4
  Top Layer w0.254: 36.68,20.95 v1(36.26,20.95) 36.01,21.21 C15.2 ; 36.68,20.95 v1(37.02,20.95) 42.72,15.26 U10.4 ; 36.68,20.95 U10.4 ; v1(38.02,22.71) 38.02,23.73 39.04,24.75 ; v1(38.02,22.71) 39.04,23.73 39.04,24.75 ; v1(38.02,22.71) v1(37.53,22.22) ; 39.04,24.75 39.04,25.51 38.38,26.16 U9.5 U9.4 ; U10.4 U10.5 ; v1(36.26,13.08) 36.26,6.1 C19.2 36.51,6.1 v1(36.51,12.32)
  Bottom Layer w0.254: v1(36.26,13.08) v1(36.26,20.95) v1(37.53,22.22) ; v1(36.51,12.32) 36.51,20.45 v1(37.02,20.95) 38.02,21.95 v1(38.02,22.71)
VCC3.3: length 188
  Top Layer w0.254: U13.8 58.33,41.92 58.33,42.29 58.84,42.8 66.46,42.8 v1(68.74,40.51) 69.5,40.51 69.6,40.42 R25.2 ; v1(122.87,22.1) 124.4,23.62 v1(124.44,23.62) ; v1(84.01,22.1) 76.9,22.1 76.64,21.84 76.52,21.84 ; v1(37.5,14.1) 36.74,14.1 36.23,14.6 36.23,14.75 36.48,15 36.74,14.75 L2.2 ; v1(119.77,30.23) 120.02,30.23 120.1,30.14 120.36,30.4 C14.1 ; v1(125.21,26.92) 125.46,27.18 125.46,28.08 126.48,29.1 v1(126.48,29.35) 126.73,29.35 127.24,29.86 131.05,29.86 133.79,27.12 v1(134.04,27.12) ; C21.2 68.44,22.05 68.64,21.84 ; v1(123.89,16) 123.89,13.97 124.14,13.72 124.4,13.72 C13.1 ; 68.64,21.84 69.15,22.35 74.99,22.35 75.75,21.59 76.26,21.59 76.52,21.84 ; 68.64,21.84 64.58,17.78 v1(61.28,17.78) 56.7,13.21 56.7,12.56 56.45,12.3 56.25,12.3 56,12.56 R24.2 ; 76.52,21.84 C22.1 ; v1(128.56,27.12) U8.12
  Bottom Layer w0.254: v1(130.55,27.18) 130.74,27.38 130.99,27.12 v1(134.04,27.12) ; v1(61.28,17.78) 60.77,18.29 60.26,18.29 D4.2 60.11,21.97 59.34,22.73 59.34,22.99 57.06,25.27 ; 127.94,27.38 128.45,27.38 128.45,27.01 v1(128.56,27.12) ; 127.94,27.38 127.94,27.88 v1(126.48,29.35) ; 127.94,27.38 v1(127.94,27.12) ; v1(84.01,22.1) v1(122.87,22.1) 122.87,18.03 123.89,17.02 v1(123.89,16) ; v1(119.77,30.23) 121.9,30.23 v1(125.21,26.92) 125.21,24.38 v1(124.44,23.62) ; 57.06,25.27 50.71,18.92 42.33,18.92 v1(37.5,14.1) ; 57.06,25.27 57.06,31.11 65.69,39.75 67.98,39.75 v1(68.74,40.51)
VCC5: length 603
  Top Layer w0.254: 112.5,32.26 112.64,32.26 113.24,31.66 ; 112.5,32.26 113.17,31.59 ; 112.5,32.26 108.58,36.18 ; 112.5,32.26 112.39,32.26 108.58,36.07 108.58,36.18 ; 128,42.51 128.26,42.76 128.41,42.76 ; 128,42.51 126.22,44.29 126.22,46.83 U12.8 126.11,44.38 128,42.49 ; 128,42.51 128,42.49 ; 115.96,34.38 113.42,34.38 113.42,33.37 113.93,32.86 113.93,32.35 ; 115.96,34.38 113.93,32.35 ; 115.96,34.38 116.03,34.38 ; 121.05,35.81 123.68,38.45 125.97,38.45 128,40.48 128,42.49 ; 121.05,35.81 119.62,34.38 ; 121.05,35.81 121.02,35.81 119.75,34.54 116.2,34.54 116.03,34.38 ; 121.05,35.81 122.48,35.81 ; U2.7 60.96,58.83 60.96,58.6 ; U2.7 61.08,58.72 60.96,58.6 ; U2.7 61.59,59.47 61.59,59.72 62.1,60.23 64.13,60.23 82.42,41.94 82.42,41.69 86.74,37.37 v1(99.19,37.37) ; 116.03,34.38 119.62,34.38 ; 116.03,34.38 113.93,32.28 ; 119.62,34.38 121.04,34.38 122.48,35.81 ; 57.29,24.98 C18.1 51.52,24.74 51.28,24.98 ; 57.29,24.98 v1(57.8,25.49) ; 57.29,24.98 51.28,24.98 ; 50.2,34.04 42.2,34.04 ; 50.2,34.04 50.79,34.04 ; 50.2,34.04 50.2,36.19 ; 50.2,34.04 50.2,30.6 R22.2 ; 42.2,34.04 42.1,33.94 L1.2 39.12,34.04 42.2,34.04 ; 42.2,34.04 43.85,35.68 43.85,36.19 ; 110.35,41.17 110.36,41.18 110.36,44.99 111.89,46.51 U11.8 110.35,46.07 110.35,41.17 ; 110.35,41.17 v1(107.31,38.13) 107.82,37.62 R6.2 ; 110.35,41.17 110.35,39.62 R6.2 ; 122.48,35.81 122.48,35.82 123.75,35.82 ; 122.48,35.81 123.56,35.81 R13.2 123.75,35.82 ; v1(124.65,17.05) 124.65,13.97 ; U1.1 41.56,39.49 43.85,37.21 43.85,36.19 ; U1.1 41.59,44.2 41.59,44.45 40.32,45.72 ; U1.1 40.32,45.3 40.32,45.72 ; U1.1 44.5,41.13 49.07,41.13 49.32,41.38 57.78,41.38 57.78,40.87 58.79,39.87 69.6,39.87 70.36,39.11 70.36,25.39 68.69,23.73 68.69,22.97 ; v1(39.28,14.75) 36.87,14.75 ; 40.58,56.13 40.32,55.88 35.24,55.88 ; 40.58,56.13 35.5,56.13 35.24,55.88 ; 40.58,56.13 41.59,56.13 ; 40.32,48.26 40.32,45.72 ; 40.32,48.26 41.59,49.53 41.59,56.13 ; 40.32,48.26 40.32,54.86 41.59,56.13 ; 68.69,22.97 75.39,22.97 76.2,22.16 83.67,29.63 85.2,29.63 85.71,30.14 108.06,30.14 109.07,29.13 119.68,29.13 120.7,30.14 123.72,27.12 ; 68.69,22.97 68.69,22.6 64.51,18.41 60.11,18.41 56.3,14.6 ; 113.93,32.28 113.93,32.35 ; 113.93,32.28 113.93,30.32 C8.2 ; 113.93,32.28 113.91,32.26 113.91,32 113.4,31.5 ; 113.93,32.35 113.24,31.66 ; 41.59,56.13 42.23,56.13 C3.1 ; C17.2 51.05,25.22 51.05,29.72 ; C17.2 51.28,24.98 ; C17.2 51.12,29.64 51.05,29.72 ; 113.4,31.5 113.66,31.24 113.66,30.23 C8.2 ; 113.4,31.5 113.24,31.66 ; R3.2 59.3,56.94 60.06,57.71 ; R3.2 51.17,56.18 51.04,56.18 ; R3.2 51.8,56.94 51.04,56.18 ; R3.2 52.7,57.71 60.06,57.71 ; R22.2 50.28,33.02 50.79,33.53 50.79,34.04 ; R22.2 51.05,29.72 ; 123.75,35.82 128.07,40.14 128.07,42.42 ; 123.72,27.12 v1(123.72,26.61) ; 123.72,27.12 124.99,25.85 127.44,25.85 127.94,26.36 ; 130.27,42.76 136.96,36.07 136.96,19.5 H2.4 138.3,18.24 137.15,19.4 137.15,35.91 130.29,42.76 130.27,42.76 ; 130.27,42.76 128.41,42.76 ; 130.27,42.76 130.1,42.93 128.58,42.93 128.41,42.76 ; 113.17,31.59 113.24,31.66 ; 113.17,31.59 112.91,31.33 112.91,30.83 C8.2 ; R6.2 108.58,36.83 108.58,36.18 ; R6.2 108.07,36.69 v1(108.34,36.41) 108.58,36.18 ; 128.41,42.76 128.07,42.42 ; 127.94,26.36 127.94,27.12 128.59,27.12 ; 127.94,26.36 128.71,25.6 128.71,24.78 v1(128.45,24.52) ; 50.79,34.04 50.79,36.15 D2.2 50.7,36.19 50.2,36.19 ; 128,42.49 128.07,42.42 ; 43.85,36.19 50.2,36.19 ; v1(44.36,15.51) 55.39,15.51 56.3,14.6 ; 56.3,14.6 56.3,12.86 56.25,12.81 ; 60.06,57.71 60.96,58.6 ; 35.24,55.88 33.97,55.88 C2.2 34.02,57.45 48.5,57.45 49.77,56.18 51.04,56.18 ; 130.55,27.12 130.49,27.06 v1(130.49,24.52)
  Bottom Layer w0.254: v1(57.8,25.49) 58.31,24.98 96.91,24.98 v1(108.34,36.41) ; v1(123.72,26.61) 123.46,26.36 123.46,18.23 v1(124.65,17.05) ; v1(128.45,24.52) v1(130.49,24.52) ; v1(107.31,38.13) 106.55,37.37 v1(99.19,37.37) ; v1(44.36,15.51) 43.85,16.02 40.55,16.02 v1(39.28,14.75)
CLK: length 34.3
  Top Layer w0.254: v1(127.3,22.73) 127.3,22.31 ; 127.3,22.31 127.13,22.48 126.87,22.48 v1(126.62,22.73) ; 127.3,22.31 U8.3 127.3,20.63 121.2,14.53 119.68,14.53 ; 119.68,14.53 119.41,14.53 R20.1 118.91,13.77 119.68,14.53
  Bottom Layer w0.254: v1(126.62,22.73) v1(127.3,22.73) 133.99,22.73 137.8,26.54 138.81,26.54 139.57,27.3 139.57,29.08 H1.4
CS#: length 23
  Top Layer w0.254: v1(124.84,19.18) 124.08,19.94 ; 124.08,19.94 v1(124.84,19.94) ; 124.08,19.94 120.02,19.94 ; 120.02,19.94 119.88,19.94 R18.2 120.02,19.94
  Bottom Layer w0.254: 125.6,19.94 132.97,19.94 H1.2 ; 125.6,19.94 v1(124.84,19.94) ; 125.6,19.94 v1(124.84,19.18)
OUT1: length 38.4
  Top Layer w0.254: R2.2 51.59,52.16 61.21,52.16 62.22,53.17 62.22,53.43 U2.3 62.36,53.27 58.41,49.32 R2.2 ; R2.2 48.73,49.3 48.73,49.2 ; R2.2 48.73,49.2 ; 48.73,49.2 C1.2
OUT2: length 165.1
  Top Layer w0.254: 61.21,53.97 61.21,53.69 U2.2 61.1,53.85 61.21,53.97 ; 61.21,53.97 62.11,54.86 62.37,54.86 ; 62.37,58.67 62.37,58.95 U2.6 62.37,58.67 ; 62.37,58.67 62.37,54.86 ; v1(85.73,29.21) 102.24,12.7 118.25,12.7 ; 118.25,12.7 125.87,12.7 R28.1 ; 118.25,12.7 101.23,29.72 86.75,29.72 v1(86.5,29.46) ; 62.37,54.86 63.89,54.86 64.4,54.36 64.4,49.78 ; 64.4,49.78 64.4,49.53 83.7,30.23 v1(84.72,30.23) ; 64.4,49.78 82.94,31.24 84.72,31.24 v1(85.23,30.73)
  Bottom Layer w0.254: v1(86.5,29.46) v1(85.23,30.73) ; v1(85.73,29.21) v1(84.72,30.23)
OUT3: length 64.5
  Top Layer w0.254: v1(125.8,39.19) 126,39.39 v1(126,39.9) 126,41.42 ; v1(124.78,11.5) 125.03,11.25 125.29,11.25 125.8,10.74 ; v1(125.54,11.75) 125.8,11.5 125.8,10.74 ; 126,41.42 120.5,46.93 120.5,51.5 C7.1 119.99,57.85 ; 126,41.42 U12.1 ; 125.8,10.74 R27.2 ; 119.99,57.85 119.74,58.1 R16.1 119.99,57.96 119.99,57.85
  Bottom Layer w0.254: 125.8,16.83 125.8,12.52 ; 125.8,16.83 124.02,18.61 124.02,19.12 ; 125.8,16.83 125.8,17.34 124.02,19.12 ; 125.8,12.52 v1(124.78,11.5) ; 125.8,12.52 125.8,12.01 v1(125.54,11.75) ; 124.02,19.12 124.02,20.14 ; 124.02,20.14 125.8,21.91 125.8,22.93 ; 124.02,20.14 124.02,21.15 125.8,22.93 ; 125.8,22.93 v1(125.8,39.19) 125.8,39.69 v1(126,39.9)
SCKL: length 32.5
  Top Layer w0.254: v1(127.99,25.38) 126.47,25.38 ; 126.47,25.38 v1(126.72,25.12) ; 126.47,25.38 R17.2
  Bottom Layer w0.254: v1(126.72,25.12) 126.98,25.38 v1(127.99,25.38) ; v1(127.99,25.38) 135.87,25.38 H1.3 130.43,27.81 v1(127.99,25.38)
VMID: length 176.2
  Top Layer w0.254: 129.25,14.77 129.25,14.01 C25.1 ; 129.25,14.77 129.43,14.59 C25.1 ; 129.25,14.77 U8.6 U8.11 ; C24.2 119.82,8.51 119.06,7.75 ; C24.2 120.59,7.75 123.89,7.75 ; C24.2 119.06,7.75 119.06,7.75 ; C24.2 123.13,8.51 123.89,7.75 ; 123.89,7.75 129.43,7.75 130.19,8.51 130.19,9.78 ; v1(88.45,25.65) 106.36,7.75 ; 106.36,7.75 119.06,7.75 ; 106.36,7.75 99.25,7.75 v1(81.09,25.91) ; 130.19,9.78 129.43,10.54 C25.1 ; 130.19,9.78 130.19,13.07 C25.1 ; v1(64.32,36.58) v1(63.56,36.58) ; v1(63.56,36.58) 62.55,37.59 62.29,37.59 ; v1(63.56,36.58) 63.31,36.58 62.29,37.59 ; 62.29,37.59 60.51,37.59 59.06,36.13 U13.2 U13.1 ; 76.52,30.73 72.2,35.05 ; 72.2,35.05 v1(71.18,35.05) ; 72.2,35.05 71.44,35.81 v1(71.18,35.81)
  Bottom Layer w0.254: v1(88.45,25.65) 88.2,25.4 80.83,25.4 v1(71.18,35.05) 70.42,35.81 ; v1(81.09,25.91) v1(71.18,35.81) 70.42,35.81 ; 65.09,35.81 v1(64.32,36.58) ; 65.09,35.81 70.42,35.81 ; 65.09,35.81 64.32,35.81 v1(63.56,36.58)
$1N669: length 30.6
  Top Layer w3.81: P2.1 20.16,27.53 U1.5
$1N800: length 12.6
  Top Layer w0.254: 47.25,49.32 45.81,47.88 U1.3 43,49.32 47.25,49.32
$1N841: length 17.6
  Top Layer w0.254: 52.44,58.96 U2.8 59.57,58.98 52.46,58.98 52.44,58.96 ; 52.44,58.96 R3.1
$1N1423: length 34.1
  Bottom Layer w0.254: R29.1 74.93,47.88 83.57,47.88 ; 83.57,47.88 83.57,43.05 83.44,42.93 U3.2 86.11,45.39 P3.1 83.57,51.69 83.57,47.88
$1N1466: length 8.2
  Top Layer w0.254: R5.1 U3.1
$1N1469: length 25.6
  Top Layer w0.254: P3.2 94.35,54.23 R5.2 96.01,52.45 92.96,52.45 P3.2
  Bottom Layer w0.254: P3.2 89.92,55.5 86.36,55.5 86.11,55.75 85.85,55.5 77.98,55.5 R29.2
$1N1526: length 35.6
  Top Layer w0.254: 107.31,43.15 107.56,42.89 108.07,42.89 ; 107.31,43.15 107.81,43.15 108.07,42.89 ; 107.31,43.15 106.04,43.15 96.14,33.25 ; 108.07,42.89 108.07,44.16 102.02,50.21 ; 108.07,42.89 R4.2 ; 102.02,50.21 102.02,52.75 C4.2 101.26,50.97 102.02,50.21 ; 96.14,33.25 96.13,33.24 96.13,32.99 U3.4 96.14,33.25
$1N1768: length 72.1
  Top Layer w0.254: 108.09,32.51 R7.2 108.09,32.4 108.09,32.51 ; 108.09,32.51 108.09,33.02 ; R6.1 106.56,34.8 108.09,33.27 ; R6.1 106.56,41.91 ; R6.1 108.09,35.81 108.09,33.27 ; 107.58,41.66 v1(109.61,41.66) ; 107.58,41.66 107.07,42.16 106.56,42.16 ; 107.58,41.66 106.82,41.66 106.56,41.91 ; 107.58,41.66 107.68,41.55 v1(108.95,41.55) ; 106.56,41.91 106.56,42.16 ; 108.09,33.27 108.09,33.02 ; v1(113.77,40.89) 113.77,41.4 U11.3 114.43,41.55 v1(113.77,40.89) ; v1(113.77,40.89) 113.41,40.53 v1(112.9,40.53) ; 106.56,42.16 R4.1 ; 107.32,33.27 107.58,33.02 108.09,33.02 ; 107.32,33.27 107.83,33.27 108.09,33.02 ; 107.32,33.27 98.69,33.27 96.66,31.24 95.64,31.24 94.37,32.51 ; 94.37,32.51 83.7,32.51 U3.3 94.16,32.72 94.37,32.51
  Bottom Layer w0.254: v1(113.77,40.89) 113.01,41.66 v1(109.61,41.66) ; v1(112.9,40.53) 112.76,40.53 111.75,41.55 v1(108.95,41.55)
$1N1889: length 16.4
  Top Layer w0.254: 107.71,48.46 R8.2 102.66,52.47 C4.1 107.71,48.46
$1N1927: length 38.9
  Top Layer w0.254: 111.99,43.37 111.99,42.16 U11.1 ; 111.99,43.37 116.05,43.37 119.09,40.33 R11.3 ; 111.99,43.37 111.99,44.64 ; C5.1 112.49,52.77 112.49,46.42 ; C5.1 110.99,54.82 R9.1 110.72,59.54 C5.1 ; 111.99,44.64 111.99,45.91 112.49,46.42 ; 111.99,44.64 112.49,45.15 112.49,46.42
$1N1958: length 47.7
  Top Layer w0.254: 108.55,47.48 109.32,48.24 C5.2 ; 108.55,47.48 108.55,53.78 C5.2 ; 108.55,47.48 108.49,47.42 108.49,46.91 ; 108.49,46.91 108.24,46.66 107.22,46.66 ; 108.49,46.91 109.25,46.15 v1(109.25,45.96) ; 108.49,46.91 108.49,46.72 v1(109.25,45.96) ; v1(111.03,43.93) 111.03,41.14 111.29,40.88 ; v1(109.25,45.96) v1(109.76,45.45) ; C5.2 109.48,54.71 R9.2 109.32,59.65 C5.2 ; 107.22,46.66 106.46,47.42 R8.1 106.97,46.66 107.22,46.66 ; 111.29,40.88 111.29,44.44 v1(111.03,44.69) ; 111.29,40.88 111.54,40.63 112.05,40.63 113.06,41.64 113.06,41.9 ; 113.06,41.9 113.06,41.96 U11.2 113.06,41.9
  Bottom Layer w0.254: v1(109.76,45.45) 109.76,45.2 v1(111.03,43.93) ; v1(109.76,45.45) v1(109.25,45.96) ; v1(109.76,45.45) 110.52,44.69 v1(111.03,44.69)
$1N2705: length 13.7
  Top Layer w0.254: 117.77,34.96 117.69,34.96 R11.2 116.66,36.07 117.77,34.96 ; 117.77,34.96 119.54,34.96 120.56,35.98 120.56,42.15 C6.2
$1N2722: length 10.9
  Top Layer w0.254: 119.04,43.54 119.04,46.91 R15.2 119.54,47.35 119.54,44.05 119.04,43.54 ; 119.04,43.54 119.04,42.27 C6.1
$1N2731: length 31.6
  Top Layer w0.254: C7.2 121.39,47.76 R15.1 ; C7.2 121.39,57.85 ; C7.2 121.18,51.8 R15.1 ; R15.1 125.75,42.97 126.26,42.97 ; R15.1 121.69,47.55 126.26,42.97 ; 121.39,57.85 121.32,57.92 R16.2 121.39,58.07 121.39,57.85 ; U12.2 127.28,41.53 127.28,41.96 126.26,42.97
$1N2751: length 13.9
  Top Layer w0.254: 128.68,35.06 128.68,41.15 ; 128.68,35.06 129.83,35.06 R14.2 ; 128.68,35.06 127.41,35.06 ; 128.68,41.15 U12.3 128.68,41.4 128.68,41.15 ; 127.41,35.06 126.65,35.82 R13.1 126.14,35.06 127.41,35.06
$1N4149: length 9.3
  Top Layer w0.254: U8.1 122.33,21.39 R17.1
$1N4155: length 10
  Top Layer w0.254: U8.2 126.65,20.59 126.22,20.17 125.46,20.17 124.7,20.93 119.36,20.93 R18.1
$1N4162: length 43.4
  Top Layer w0.254: 132.97,27.3 132.97,22.72 v1(133.73,21.96) ; 132.97,27.3 135.25,25.01 v1(135.25,20.44) ; 132.97,27.3 130.94,29.33 127.38,29.33 126.11,28.06 126.11,27.3 ; v1(132.21,20.69) 131.95,20.44 131.95,14.34 R19.2 134.24,15.61 v1(134.75,16.12) ; 126.11,27.3 126.11,27.24 U8.16 126.11,27.3
  Bottom Layer w0.254: v1(133.73,21.96) 133.48,21.96 v1(132.21,20.69) ; v1(135.25,20.44) 134.75,19.93 v1(134.75,16.12)
$1N4196: length 31.5
  Top Layer w0.254: v1(125.03,10.54) 124.01,9.52 124.01,8.76 ; 124.01,8.76 123.51,8.76 123,9.27 119.19,9.27 C24.1 ; 124.01,8.76 124.15,8.76 R27.1 124.16,8.62 124.01,8.76 ; 124.01,8.76 v1(125.03,9.78) ; v1(129.86,15.11) v1(129.86,15.87) 129.86,21.35 U8.7
  Bottom Layer w0.254: v1(129.86,15.11) 125.28,10.54 v1(125.03,10.54) ; v1(129.86,15.11) 129.86,14.6 v1(125.03,9.78) ; v1(129.86,15.11) v1(129.86,15.87)
$1N4201: length 24.5
  Top Layer w0.254: 131.34,18.91 131.34,14.34 C25.2 ; 131.34,18.91 131.34,21.96 129.9,23.4 U8.10 ; 131.34,18.91 130.57,18.15 130.57,14.08 C25.2 ; 130.83,9.26 130.83,9.24 R28.2 130.83,9.26 ; 130.83,9.26 C25.2
$1N4991: length 49.9
  Top Layer w0.254: 127.73,28.32 130.68,28.32 131.19,27.81 131.19,22.73 H2.3 ; 127.73,28.32 127.3,27.88 U8.14 ; 127.73,28.32 127.89,28.48 v1(128.4,28.48)
  Bottom Layer w0.254: H2.3 140.08,17.4 140.08,30.35 138.81,31.62 137.8,31.62 134.65,28.48 v1(128.4,28.48)
$1N5106: length 4.3
  Top Layer w0.254: H2.1 134.49,10.54 ; 134.49,10.54 R19.1 134.25,10.54 134.49,10.54
$1N5113: length 36.2
  Top Layer w0.254: 127.73,28.9 126.65,27.81 ; 127.73,28.9 127.66,28.9 126.65,27.88 126.65,27.81 ; 127.73,28.9 130.78,28.9 131.66,28.02 ; 126.65,27.81 U8.15 ; 131.8,22.99 131.8,27.88 131.66,28.02 ; 131.8,22.99 131.66,23.12 131.66,28.02 ; 131.8,22.99 137.89,16.89 138.65,16.89 139.42,16.13 ; 139.67,15.62 139.67,15.87 139.42,16.13 ; 139.67,15.62 139.67,14.45 H2.2 138.3,14 139.42,15.11 139.42,15.37 139.67,15.62 ; 139.67,15.62 139.42,15.87 139.42,16.13
$1N6988: length 28.8
  Top Layer w0.254: 42.79,24.61 42.28,25.12 42.28,26.06 41.27,27.07 41.01,27.07 U9.3 41.48,27.11 42.79,25.8 ; 42.79,24.61 42.79,25.8 ; 42.79,24.61 R21.2 ; 42.79,24.61 43.98,25.8 ; 42.79,25.8 43.98,25.8 ; 43.98,25.8 48.63,30.46 R22.1 44.1,25.8 43.98,25.8
$1N7005: length 31
  Top Layer w0.254: 33.3,29.11 37.11,25.3 ; 33.3,29.11 27.97,23.78 D1.2 33.3,29.03 33.3,29.11 ; 33.3,29.11 C16.1 36.6,33.94 L1.1 ; 37.11,25.3 37.87,25.3 U9.6 37.2,25.21 37.11,25.3
$1N7153: length 35.3
  Top Layer w0.254: 38.6,27.84 39.87,26.57 39.87,25.7 ; 38.6,27.84 38.34,28.09 38.34,31.14 ; 38.6,27.84 38.85,28.09 38.85,30.63 38.34,31.14 ; 38.6,27.84 37.5,27.84 ; 38.34,31.14 38.34,34.55 ; 39.87,25.7 40.02,25.55 40.38,25.55 40.63,25.3 ; 39.87,25.7 39.87,25.55 40.12,25.3 40.63,25.3 ; 38.34,34.55 38.49,34.7 41.14,34.7 D2.1 42.61,36.22 39.87,36.22 38.34,34.7 38.34,34.55 ; 40.63,25.3 U9.1 ; 37.5,27.84 37.24,27.59 36.23,27.59 C16.2 35.46,29.87 37.5,27.84
$1N7802: length 35.7
  Top Layer w0.254: R24.1 52.71,14.84 ; R24.1 54.73,12.55 54.73,8.74 51.17,5.19 51.17,9.24 R24.1 ; 52.71,14.84 45.6,14.84 U10.3 52.64,14.92 52.71,14.84
$1N7806: length 37.2
  Top Layer w0.254: 36.44,13.78 35.93,13.78 35.67,13.53 35.67,13.02 35.47,13.23 L2.1 ; 36.44,13.78 37.2,13.02 U10.6 ; 36.44,13.78 L2.1 ; C20.1 24.95,14.86 24.95,14.35 ; L2.1 27.13,14.75 26.73,14.35 ; L2.1 35.07,14.35 26.73,14.35 ; 24.95,9.3 24.95,9.27 D3.2 24.95,9.3 ; 24.95,9.3 24.95,14.35 ; 26.73,14.35 24.95,14.35
$1N7825: length 48.1
  Top Layer w0.254: v1(44.34,14.6) v1(44.34,13.84) ; v1(44.34,13.84) 44.6,13.59 44.6,13.33 ; v1(44.34,13.84) 44.34,13.59 44.6,13.33 ; 27.37,15.62 39.31,15.62 ; 27.37,15.62 26.86,15.11 C20.2 26.61,15.62 27.37,15.62 ; 39.31,15.62 41.09,13.84 v1(41.59,13.84) ; 39.31,15.62 40.58,15.62 v1(40.83,15.37) ; 44.6,13.33 44.85,13.08 45.36,13.08 U10.1
  Bottom Layer w0.254: 44.34,14.1 43.37,14.1 43.12,13.84 v1(41.59,13.84) ; 44.34,14.1 44.85,14.6 ; 44.34,14.1 v1(44.34,13.84) ; 44.85,14.6 48.66,18.41 D4.1 48.1,14.6 44.85,14.6 ; 44.85,14.6 v1(44.34,14.6) 44.09,14.35 41.85,14.35 v1(40.83,15.37)
$1N8191: length 19.6
  Top Layer w0.254: 68.9,36.4 69.6,37.09 R25.1 68.9,37.67 68.9,36.4 ; 68.9,36.4 68.9,35.89 ; 60.52,36.14 60.52,36.03 U13.3 60.26,35.89 60.52,36.14 ; 60.52,36.14 60.52,36.4 61.28,37.16 62.04,37.16 63.31,35.89 68.9,35.89 ; 68.9,35.89 R26.2
$1N8643: length 10.8
  Top Layer w3.81: P2.2 8.13,28.66 U14.2
$1N8649: length 15.9
  Top Layer w3.81: U1.4 15.42,55.55 U14.1
